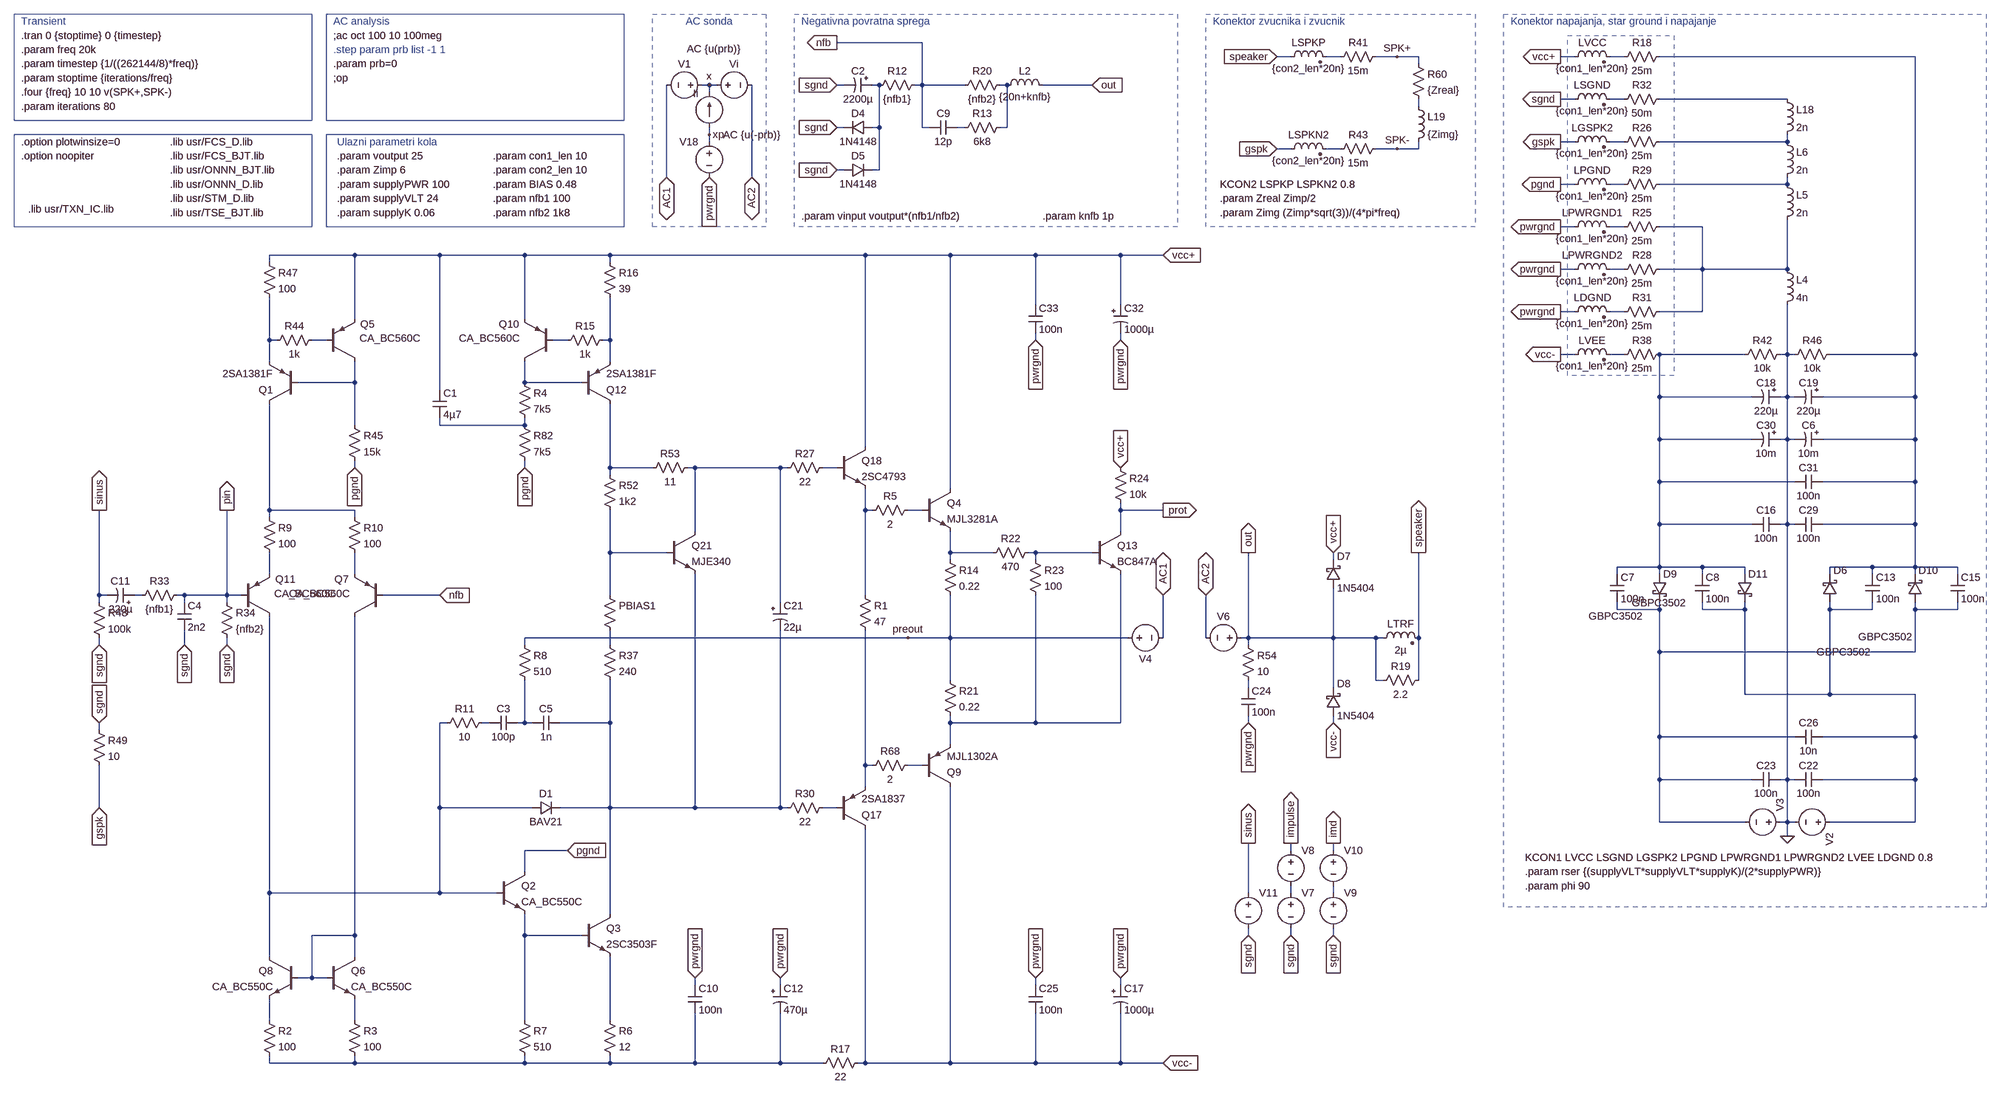
[diagram p0: schematic nano.asc]
nano.asc, the LTspice schematic file:
Version 4
SHEET 1 6124 2336
WIRE 1472 -1568 1280 -1568
WIRE 2304 -1536 2272 -1536
WIRE 2416 -1536 2384 -1536
WIRE 2544 -1536 2496 -1536
WIRE 2592 -1536 2544 -1536
WIRE 2944 -1536 2912 -1536
WIRE 3056 -1536 3024 -1536
WIRE 3712 -1536 3136 -1536
WIRE 2592 -1520 2592 -1536
WIRE 992 -1472 976 -1472
WIRE 1008 -1472 992 -1472
WIRE 1296 -1472 1280 -1472
WIRE 1376 -1472 1360 -1472
WIRE 1472 -1472 1472 -1568
WIRE 1472 -1472 1456 -1472
WIRE 1568 -1472 1472 -1472
WIRE 1664 -1472 1648 -1472
WIRE 1856 -1472 1744 -1472
WIRE 992 -1456 992 -1472
WIRE 2944 -1440 2912 -1440
WIRE 3056 -1440 3024 -1440
WIRE 3424 -1440 3136 -1440
WIRE 2592 -1424 2592 -1440
WIRE 1296 -1376 1280 -1376
WIRE 1376 -1376 1376 -1472
WIRE 1376 -1376 1360 -1376
WIRE 1472 -1376 1472 -1472
WIRE 1488 -1376 1472 -1376
WIRE 1568 -1376 1552 -1376
WIRE 1664 -1376 1664 -1472
WIRE 1664 -1376 1648 -1376
WIRE 992 -1360 992 -1376
WIRE 992 -1344 992 -1360
WIRE 2944 -1344 2912 -1344
WIRE 3056 -1344 3024 -1344
WIRE 3424 -1344 3424 -1360
WIRE 3424 -1344 3136 -1344
WIRE 2304 -1328 2272 -1328
WIRE 2416 -1328 2384 -1328
WIRE 2544 -1328 2496 -1328
WIRE 2592 -1328 2592 -1344
WIRE 2592 -1328 2544 -1328
WIRE 1296 -1280 1280 -1280
WIRE 1376 -1280 1376 -1376
WIRE 1376 -1280 1360 -1280
WIRE 896 -1264 896 -1472
WIRE 1088 -1264 1088 -1472
WIRE 2944 -1248 2912 -1248
WIRE 3056 -1248 3024 -1248
WIRE 3424 -1248 3424 -1264
WIRE 3424 -1248 3136 -1248
WIRE 2944 -1152 2912 -1152
WIRE 3056 -1152 3024 -1152
WIRE 3232 -1152 3136 -1152
WIRE 192 -1088 0 -1088
WIRE 384 -1088 192 -1088
WIRE 576 -1088 384 -1088
WIRE 768 -1088 576 -1088
WIRE 1344 -1088 768 -1088
WIRE 1440 -1088 1344 -1088
WIRE 1536 -1088 1440 -1088
WIRE 1728 -1088 1536 -1088
WIRE 1920 -1088 1728 -1088
WIRE 2016 -1088 1920 -1088
WIRE 0 -1072 0 -1088
WIRE 768 -1072 768 -1088
WIRE 2944 -1056 2912 -1056
WIRE 3056 -1056 3024 -1056
WIRE 3232 -1056 3232 -1152
WIRE 3232 -1056 3136 -1056
WIRE 3424 -1056 3424 -1168
WIRE 3424 -1056 3232 -1056
WIRE 1728 -976 1728 -1088
WIRE 1920 -976 1920 -1088
WIRE 2944 -960 2912 -960
WIRE 3056 -960 3024 -960
WIRE 3232 -960 3232 -1056
WIRE 3232 -960 3136 -960
WIRE 192 -944 192 -1088
WIRE 576 -944 576 -1088
WIRE 0 -896 0 -992
WIRE 16 -896 0 -896
WIRE 128 -896 96 -896
WIRE 672 -896 640 -896
WIRE 768 -896 768 -992
WIRE 768 -896 752 -896
WIRE 1344 -896 1344 -1088
WIRE 1536 -896 1536 -1088
WIRE 1728 -896 1728 -912
WIRE 1920 -896 1920 -912
WIRE 2944 -864 2912 -864
WIRE 3056 -864 3024 -864
WIRE 3328 -864 3136 -864
WIRE 3424 -864 3424 -976
WIRE 3424 -864 3408 -864
WIRE 3440 -864 3424 -864
WIRE 3712 -864 3712 -1536
WIRE 3712 -864 3520 -864
WIRE 0 -848 0 -896
WIRE 768 -848 768 -896
WIRE 192 -800 192 -848
WIRE 192 -800 64 -800
WIRE 576 -800 576 -848
WIRE 704 -800 576 -800
WIRE 384 -784 384 -1088
WIRE 3136 -768 3136 -864
WIRE 3344 -768 3136 -768
WIRE 3424 -768 3424 -864
WIRE 3424 -768 3408 -768
WIRE 3440 -768 3424 -768
WIRE 3712 -768 3712 -864
WIRE 3712 -768 3504 -768
WIRE 192 -704 192 -800
WIRE 384 -704 384 -720
WIRE 576 -704 576 -720
WIRE 576 -704 384 -704
WIRE 0 -672 0 -752
WIRE 768 -672 768 -752
WIRE 3136 -672 3136 -768
WIRE 3344 -672 3136 -672
WIRE 3424 -672 3424 -768
WIRE 3424 -672 3408 -672
WIRE 3440 -672 3424 -672
WIRE 3712 -672 3712 -768
WIRE 3712 -672 3504 -672
WIRE 1344 -656 1344 -896
WIRE 192 -608 192 -624
WIRE 576 -608 576 -624
WIRE 768 -608 768 -672
WIRE 864 -608 768 -608
WIRE 960 -608 944 -608
WIRE 1152 -608 960 -608
WIRE 1168 -608 1152 -608
WIRE 1280 -608 1248 -608
WIRE 768 -592 768 -608
WIRE 3136 -576 3136 -672
WIRE 3440 -576 3136 -576
WIRE 3712 -576 3712 -672
WIRE 3712 -576 3504 -576
WIRE 1536 -560 1536 -896
WIRE 0 -512 0 -672
WIRE 192 -512 0 -512
WIRE 1344 -512 1344 -560
WIRE 1360 -512 1344 -512
WIRE 1472 -512 1440 -512
WIRE 1920 -512 1920 -528
WIRE 2016 -512 1920 -512
WIRE 0 -496 0 -512
WIRE 192 -496 192 -512
WIRE 3136 -480 3136 -576
WIRE 3344 -480 3136 -480
WIRE 3424 -480 3424 -672
WIRE 3424 -480 3408 -480
WIRE 3440 -480 3424 -480
WIRE 3712 -480 3712 -576
WIRE 3712 -480 3504 -480
WIRE 960 -464 960 -608
WIRE 1920 -464 1920 -512
WIRE 768 -416 768 -512
WIRE 896 -416 768 -416
WIRE 1536 -416 1536 -464
WIRE 1632 -416 1536 -416
WIRE 1728 -416 1712 -416
WIRE 1856 -416 1728 -416
WIRE 1536 -400 1536 -416
WIRE 1728 -400 1728 -416
WIRE 2400 -400 2400 -416
WIRE 3136 -384 3136 -480
WIRE 3136 -384 3040 -384
WIRE 3232 -384 3136 -384
WIRE 3328 -384 3232 -384
WIRE 3616 -384 3520 -384
WIRE 3712 -384 3712 -480
WIRE 3712 -384 3616 -384
WIRE 3808 -384 3712 -384
WIRE 0 -368 0 -416
WIRE 192 -368 192 -416
WIRE 3040 -368 3040 -384
WIRE 3136 -368 3136 -384
WIRE 3232 -368 3232 -384
WIRE 3328 -368 3328 -384
WIRE 3520 -368 3520 -384
WIRE 3616 -368 3616 -384
WIRE 3712 -368 3712 -384
WIRE 3808 -368 3808 -384
WIRE -384 -320 -384 -512
WIRE -368 -320 -384 -320
WIRE -288 -320 -304 -320
WIRE -192 -320 -208 -320
WIRE -96 -320 -96 -512
WIRE -96 -320 -192 -320
WIRE -64 -320 -96 -320
WIRE 384 -320 256 -320
WIRE 768 -320 768 -416
WIRE 1344 -320 1344 -512
WIRE -384 -304 -384 -320
WIRE -192 -304 -192 -320
WIRE -96 -304 -96 -320
WIRE 1152 -304 1152 -608
WIRE 3040 -288 3040 -304
WIRE 3136 -288 3136 -304
WIRE 3136 -288 3040 -288
WIRE 3232 -288 3232 -304
WIRE 3328 -288 3328 -304
WIRE 3328 -288 3232 -288
WIRE 3520 -288 3520 -304
WIRE 3616 -288 3616 -304
WIRE 3616 -288 3520 -288
WIRE 3712 -288 3712 -304
WIRE 3808 -288 3808 -304
WIRE 3808 -288 3712 -288
WIRE 1440 -224 576 -224
WIRE 1536 -224 1536 -320
WIRE 1536 -224 1440 -224
WIRE 1632 -224 1536 -224
WIRE 1936 -224 1632 -224
WIRE 2016 -224 2016 -320
WIRE 2112 -224 2112 -320
WIRE 2208 -224 2208 -416
WIRE 2208 -224 2192 -224
WIRE 2400 -224 2400 -336
WIRE 2400 -224 2208 -224
WIRE 2496 -224 2400 -224
WIRE 2512 -224 2496 -224
WIRE 2592 -224 2592 -416
WIRE -384 -208 -384 -224
WIRE -192 -208 -192 -240
WIRE -96 -208 -96 -224
WIRE 576 -208 576 -224
WIRE 768 -208 768 -240
WIRE 2208 -208 2208 -224
WIRE 3136 -192 3136 -288
WIRE 3712 -192 3712 -288
WIRE 3712 -192 3136 -192
WIRE 1536 -128 1536 -224
WIRE 2496 -128 2496 -224
WIRE 2512 -128 2496 -128
WIRE 2592 -128 2592 -224
WIRE 2208 -112 2208 -128
WIRE 2400 -112 2400 -224
WIRE 3328 -96 3328 -288
WIRE 3520 -96 3520 -288
WIRE 3520 -96 3328 -96
WIRE 3712 -96 3520 -96
WIRE 400 -32 384 -32
WIRE 496 -32 480 -32
WIRE 576 -32 576 -128
WIRE 576 -32 560 -32
WIRE 592 -32 576 -32
WIRE 768 -32 768 -128
WIRE 768 -32 656 -32
WIRE 1536 -32 1536 -48
WIRE 1728 -32 1728 -320
WIRE 1728 -32 1536 -32
WIRE 1920 -32 1920 -368
WIRE 1920 -32 1728 -32
WIRE 2208 -32 2208 -48
WIRE 2400 -32 2400 -48
WIRE -384 -16 -384 -32
WIRE 3136 0 3136 -192
WIRE 3440 0 3136 0
WIRE 3712 0 3712 -96
WIRE 3712 0 3504 0
WIRE 1536 16 1536 -32
WIRE 1344 64 1344 -240
WIRE 1360 64 1344 64
WIRE 1472 64 1440 64
WIRE 3136 96 3136 0
WIRE 3344 96 3136 96
WIRE 3424 96 3424 -480
WIRE 3424 96 3408 96
WIRE 3440 96 3424 96
WIRE 3712 96 3712 0
WIRE 3712 96 3504 96
WIRE 1344 112 1344 64
WIRE -384 160 -384 64
WIRE 384 160 384 -32
WIRE 592 160 384 160
WIRE 768 160 768 -32
WIRE 768 160 656 160
WIRE 960 160 960 -368
WIRE 960 160 768 160
WIRE 1152 160 1152 -240
WIRE 1152 160 960 160
WIRE 1168 160 1152 160
WIRE 1280 160 1248 160
WIRE 3136 192 3136 96
WIRE 3328 192 3136 192
WIRE 3424 192 3424 96
WIRE 3424 192 3408 192
WIRE 3440 192 3424 192
WIRE 3712 192 3712 96
WIRE 3712 192 3520 192
WIRE 3424 224 3424 192
WIRE 672 256 576 256
WIRE 2304 256 2304 240
WIRE 2400 256 2400 240
WIRE 576 304 576 256
WIRE 0 352 0 -272
WIRE 384 352 384 160
WIRE 384 352 0 352
WIRE 512 352 384 352
WIRE 2208 352 2208 240
WIRE 2304 352 2304 336
WIRE 2400 352 2400 336
WIRE 768 400 768 160
WIRE 192 448 192 -272
WIRE 192 448 96 448
WIRE 576 448 576 400
WIRE 704 448 576 448
WIRE 2208 448 2208 432
WIRE 2304 448 2304 432
WIRE 2400 448 2400 432
WIRE 0 496 0 352
WIRE 192 496 192 448
WIRE 96 544 96 448
WIRE 96 544 64 544
WIRE 128 544 96 544
WIRE 960 560 960 544
WIRE 1152 560 1152 544
WIRE 1728 560 1728 544
WIRE 1920 560 1920 544
WIRE 0 640 0 592
WIRE 192 640 192 592
WIRE 576 640 576 448
WIRE 768 640 768 496
WIRE 0 736 0 720
WIRE 192 736 192 720
WIRE 192 736 0 736
WIRE 576 736 576 720
WIRE 576 736 192 736
WIRE 768 736 768 720
WIRE 768 736 576 736
WIRE 960 736 960 624
WIRE 960 736 768 736
WIRE 1152 736 1152 624
WIRE 1152 736 960 736
WIRE 1248 736 1152 736
WIRE 1344 736 1344 208
WIRE 1344 736 1328 736
WIRE 1440 736 1344 736
WIRE 1536 736 1536 112
WIRE 1536 736 1440 736
WIRE 1728 736 1728 624
WIRE 1728 736 1536 736
WIRE 1920 736 1920 624
WIRE 1920 736 1728 736
WIRE 2016 736 1920 736
FLAG 2016 -1088 vcc+
IOPIN 2016 -1088 In
FLAG 992 -1472 x
FLAG 2016 736 vcc-
IOPIN 2016 736 In
FLAG 2208 -416 out
IOPIN 2208 -416 Out
FLAG 1280 -1568 nfb
IOPIN 1280 -1568 Out
FLAG 384 -320 nfb
IOPIN 384 -320 In
FLAG 992 -1360 xp
FLAG 2208 -32 pwrgnd
IOPIN 2208 -32 In
FLAG -192 -208 sgnd
IOPIN -192 -208 In
FLAG -96 -208 sgnd
IOPIN -96 -208 In
FLAG 1280 -1472 sgnd
IOPIN 1280 -1472 In
FLAG 2208 448 sgnd
IOPIN 2208 448 In
FLAG 2208 240 sinus
IOPIN 2208 240 Out
FLAG 1152 544 pwrgnd
IOPIN 1152 544 In
FLAG 192 -608 pgnd
IOPIN 192 -608 In
FLAG 576 -608 pgnd
IOPIN 576 -608 In
FLAG 2912 -1536 vcc+
IOPIN 2912 -1536 Out
FLAG 2912 -864 vcc-
IOPIN 2912 -864 Out
FLAG 2912 -1344 gspk
IOPIN 2912 -1344 Out
FLAG 2912 -1056 pwrgnd
IOPIN 2912 -1056 Out
FLAG 2912 -1248 pgnd
IOPIN 2912 -1248 Out
FLAG 2912 -1440 sgnd
IOPIN 2912 -1440 Out
FLAG 1856 -1472 out
IOPIN 1856 -1472 In
FLAG 2592 -416 speaker
IOPIN 2592 -416 Out
FLAG 2272 -1328 gspk
IOPIN 2272 -1328 In
FLAG 2272 -1536 speaker
IOPIN 2272 -1536 In
FLAG 2912 -1152 pwrgnd
IOPIN 2912 -1152 Out
FLAG 960 544 pwrgnd
IOPIN 960 544 In
FLAG 2304 240 impulse
IOPIN 2304 240 Out
FLAG 2912 -960 pwrgnd
IOPIN 2912 -960 Out
FLAG 3424 224 0
FLAG 896 -1264 AC1
IOPIN 896 -1264 BiDir
FLAG 1088 -1264 AC2
IOPIN 1088 -1264 BiDir
FLAG 2016 -320 AC1
IOPIN 2016 -320 BiDir
FLAG 2112 -320 AC2
IOPIN 2112 -320 BiDir
FLAG 992 -1264 pwrgnd
IOPIN 992 -1264 In
FLAG 2544 -1536 SPK+
FLAG 2544 -1328 SPK-
FLAG 2400 240 imd
IOPIN 2400 240 Out
FLAG 672 256 pgnd
IOPIN 672 256 In
FLAG 2400 -416 vcc+
IOPIN 2400 -416 In
FLAG 2400 -32 vcc-
IOPIN 2400 -32 In
FLAG 2304 448 sgnd
IOPIN 2304 448 In
FLAG 2400 448 sgnd
IOPIN 2400 448 In
FLAG 1728 544 pwrgnd
IOPIN 1728 544 In
FLAG 1920 544 pwrgnd
IOPIN 1920 544 In
FLAG 1920 -896 pwrgnd
IOPIN 1920 -896 In
FLAG 1728 -896 pwrgnd
IOPIN 1728 -896 In
FLAG -384 -208 sgnd
IOPIN -384 -208 In
FLAG -384 -32 sgnd
IOPIN -384 -32 In
FLAG -384 160 gspk
IOPIN -384 160 In
FLAG 1440 -224 preout
FLAG -96 -512 pin
IOPIN -96 -512 Out
FLAG 1280 -1376 sgnd
IOPIN 1280 -1376 In
FLAG 1280 -1280 sgnd
IOPIN 1280 -1280 In
FLAG 2016 -512 prot
IOPIN 2016 -512 Out
FLAG 1920 -608 vcc+
IOPIN 1920 -608 In
FLAG -384 -512 sinus
IOPIN -384 -512 Out
DATAFLAG 768 -672 "-Ic(Q12)"
DATAFLAG 1440 -1088 ""
DATAFLAG 1440 736 ""
DATAFLAG 1344 -896 "Ic(Q18)"
DATAFLAG 0 -672 "-Ic(Q1)"
DATAFLAG 1632 -224 ""
DATAFLAG 1536 -896 "Ic(Q4)"
SYMBOL res 1472 -1488 R90
WINDOW 0 0 56 VBottom 2
WINDOW 3 32 56 VTop 2
SYMATTR InstName R12
SYMATTR Value {nfb1}
SYMBOL voltage 3536 192 R90
WINDOW 123 0 0 Left 2
WINDOW 3 -94 177 Invisible 2
SYMATTR Value SINE(0 {supplyVLT*sqrt(2)} 50 1m 0 {phi})
SYMATTR SpiceLine Rser={rser}
SYMATTR InstName V2
SYMBOL current 992 -1376 R180
WINDOW 0 24 77 Left 2
WINDOW 3 24 0 Invisible 2
WINDOW 123 -71 178 Left 2
WINDOW 39 0 0 Left 2
SYMATTR InstName Ii
SYMATTR Value 0
SYMATTR Value2 AC {u(prb)}
SYMBOL voltage 992 -1472 R270
WINDOW 0 32 56 VTop 2
WINDOW 3 -32 56 Invisible 2
WINDOW 123 -97 96 VBottom 2
WINDOW 39 -32 56 VBottom 2
SYMATTR InstName Vi
SYMATTR Value 0
SYMATTR Value2 AC {u(-prb)}
SYMBOL pnp -64 -272 M180
WINDOW 0 77 84 Left 2
WINDOW 3 75 52 Left 2
SYMATTR InstName Q11
SYMATTR Value CA_BC560C
SYMBOL res -304 -304 R270
WINDOW 0 32 56 VTop 2
WINDOW 3 0 56 VBottom 2
SYMATTR InstName R33
SYMATTR Value {nfb1}
SYMBOL res -112 -320 R0
SYMATTR InstName R34
SYMATTR Value {nfb2}
SYMBOL res -16 624 R0
SYMATTR InstName R2
SYMATTR Value 100
SYMBOL res 176 624 R0
SYMATTR InstName R3
SYMATTR Value 100
SYMBOL res -16 -512 R0
SYMATTR InstName R9
SYMATTR Value 100
SYMBOL res 176 -512 R0
SYMATTR InstName R10
SYMATTR Value 100
SYMBOL res 752 -1088 R0
SYMATTR InstName R16
SYMATTR Value 39
SYMBOL pnp 704 -752 M180
SYMATTR InstName Q12
SYMATTR Value 2SA1381F
SYMBOL schottky 2384 -336 M180
WINDOW 0 24 72 Left 2
WINDOW 3 24 0 Left 2
SYMATTR InstName D7
SYMATTR Value 1N5404
SYMATTR Description Diode
SYMATTR Type diode
SYMBOL schottky 2384 -48 M180
WINDOW 0 24 72 Left 2
WINDOW 3 24 0 Left 2
SYMATTR InstName D8
SYMATTR Value 1N5404
SYMATTR Description Diode
SYMATTR Type diode
SYMBOL ind2 2496 -208 R270
WINDOW 0 32 56 VTop 2
WINDOW 3 4 56 VBottom 2
SYMATTR InstName LTRF
SYMATTR Value 2µ
SYMATTR SpiceLine Rser=10m Rpar=3meg Cpar=1p
SYMATTR Type ind
SYMBOL res 2496 -112 R270
WINDOW 0 32 56 VTop 2
WINDOW 3 0 56 VBottom 2
SYMATTR InstName R19
SYMATTR Value 2.2
SYMBOL res 1664 -1488 R90
WINDOW 0 0 56 VBottom 2
WINDOW 3 32 56 VTop 2
SYMATTR InstName R20
SYMATTR Value {nfb2}
SYMBOL voltage 992 -1472 R90
WINDOW 0 -32 56 VBottom 2
WINDOW 3 32 56 Invisible 2
WINDOW 123 0 0 Left 2
WINDOW 39 0 0 Left 2
SYMATTR InstName V1
SYMATTR Value 0
SYMBOL schottky 3504 -304 M180
WINDOW 0 24 72 Left 2
WINDOW 3 -14 -112 Left 2
SYMATTR InstName D6
SYMATTR Value GBPC3502
SYMATTR Description Diode
SYMATTR Type diode
SYMBOL schottky 3120 -368 R0
WINDOW 3 -144 95 Left 2
SYMATTR Value GBPC3502
SYMATTR InstName D9
SYMATTR Description Diode
SYMATTR Type diode
SYMBOL voltage 3424 192 M270
WINDOW 123 0 0 Left 2
WINDOW 3 -96 -62 Invisible 2
SYMATTR Value SINE(0 {supplyVLT*sqrt(2)} 50 1m 0 {phi})
SYMATTR SpiceLine Rser={rser}
SYMATTR InstName V3
SYMBOL res 2192 -224 R0
SYMATTR InstName R54
SYMATTR Value 10
SYMBOL res 2576 -1536 R0
SYMATTR InstName R60
SYMATTR Value {Zreal}
SYMBOL ind 2576 -1440 R0
SYMATTR InstName L19
SYMATTR Value {Zimg}
SYMATTR SpiceLine Cpar=10p
SYMBOL voltage 992 -1360 M0
WINDOW 123 0 0 Left 2
WINDOW 39 0 0 Left 2
WINDOW 3 24 96 Invisible 2
SYMATTR Value 0
SYMATTR InstName V18
SYMBOL pnp 1280 208 M180
SYMATTR InstName Q17
SYMATTR Value 2SA1837
SYMBOL npn 1280 -656 R0
SYMATTR InstName Q18
SYMATTR Value 2SC4793
SYMBOL res 1264 -624 R90
WINDOW 0 0 56 VBottom 2
WINDOW 3 32 56 VTop 2
SYMATTR InstName R27
SYMATTR Value 22
SYMBOL res 1264 144 R90
WINDOW 0 0 56 VBottom 2
WINDOW 3 32 56 VTop 2
SYMATTR InstName R30
SYMATTR Value 22
SYMBOL cap 2192 -112 R0
SYMATTR InstName C24
SYMATTR Value 100n
SYMATTR SpiceLine Rser=700m Lser=7n Rpar=4.4meg Cpar=1p
SYMBOL cap 1712 624 M180
WINDOW 0 24 56 Left 2
WINDOW 3 24 8 Left 2
SYMATTR InstName C25
SYMATTR Value 100n
SYMATTR SpiceLine Rser=700m Lser=7n Rpar=4.4meg Cpar=1p
SYMBOL polcap 1360 -1488 R90
WINDOW 0 0 32 VBottom 2
WINDOW 3 32 32 VTop 2
SYMATTR InstName C2
SYMATTR Value 2200µ
SYMATTR SpiceLine V=6.3 Irms=1.44 Rser=0.09 Lser=5.5n Rpar=1110k Cpar=3p mfg="Nichicon" pn="UPW0J222MPD6TD" type="Al electrolytic"
SYMATTR Description Capacitor
SYMATTR Type cap
SYMBOL res -16 -1088 R0
SYMATTR InstName R47
SYMATTR Value 100
SYMBOL res 752 -336 R0
WINDOW 3 36 76 Invisible 2
SYMATTR Value {1+(500*BIAS)}
SYMATTR InstName PBIAS1
SYMBOL res 752 -608 R0
SYMATTR InstName R52
SYMATTR Value 1k2
SYMBOL res 960 -624 R90
WINDOW 0 0 56 VBottom 2
WINDOW 3 32 56 VTop 2
SYMATTR InstName R53
SYMATTR Value 11
SYMBOL schottky 3696 -304 M180
WINDOW 0 24 72 Left 2
WINDOW 3 -112 -78 Left 2
SYMATTR InstName D10
SYMATTR Value GBPC3502
SYMATTR Description Diode
SYMATTR Type diode
SYMBOL schottky 3312 -368 R0
WINDOW 3 -239 65 Left 2
SYMATTR Value GBPC3502
SYMATTR InstName D11
SYMATTR Description Diode
SYMATTR Type diode
SYMBOL ind2 2928 -1520 R270
WINDOW 0 32 56 VTop 2
WINDOW 3 5 56 VBottom 2
SYMATTR InstName LVCC
SYMATTR Value {con1_len*20n}
SYMATTR SpiceLine Rser={con1_len*.5m}
SYMATTR Type ind
SYMBOL ind2 2928 -848 R270
WINDOW 0 32 56 VTop 2
WINDOW 3 5 56 VBottom 2
SYMATTR InstName LVEE
SYMATTR Value {con1_len*20n}
SYMATTR SpiceLine Rser={con1_len*.5m}
SYMATTR Type ind
SYMBOL npn 704 400 R0
SYMATTR InstName Q3
SYMATTR Value 2SC3503F
SYMBOL res 752 624 R0
SYMATTR InstName R6
SYMATTR Value 12
SYMBOL voltage 2208 336 R0
WINDOW 123 24 44 Left 2
WINDOW 39 0 0 Left 2
WINDOW 3 24 96 Invisible 2
SYMATTR Value SINE(0 {vinput} {freq})
SYMATTR InstName V11
SYMBOL res 560 -816 R0
SYMATTR InstName R4
SYMATTR Value 7k5
SYMBOL res 1328 -336 R0
SYMATTR InstName R1
SYMATTR Value 47
SYMBOL pnp 64 -752 R180
SYMATTR InstName Q1
SYMATTR Value 2SA1381F
SYMBOL pnp 256 -272 R180
WINDOW 0 77 84 Left 2
WINDOW 3 75 52 Left 2
SYMATTR InstName Q7
SYMATTR Value CA_BC560C
SYMBOL npn 896 -464 R0
SYMATTR InstName Q21
SYMATTR Value MJE340
SYMBOL res 1344 720 R90
WINDOW 0 0 56 VBottom 2
WINDOW 3 32 56 VTop 2
SYMATTR InstName R17
SYMATTR Value 22
SYMBOL ind2 2928 -1328 R270
WINDOW 0 32 56 VTop 2
WINDOW 3 5 56 VBottom 2
SYMATTR InstName LGSPK2
SYMATTR Value {con1_len*20n}
SYMATTR SpiceLine Rser={con1_len*.5m}
SYMATTR Type ind
SYMBOL ind2 2928 -1040 R270
WINDOW 0 32 56 VTop 2
WINDOW 3 5 56 VBottom 2
SYMATTR InstName LPWRGND2
SYMATTR Value {con1_len*20n}
SYMATTR SpiceLine Rser={con1_len*.5m}
SYMATTR Type ind
SYMBOL ind2 2928 -1232 R270
WINDOW 0 32 56 VTop 2
WINDOW 3 5 56 VBottom 2
SYMATTR InstName LPGND
SYMATTR Value {con1_len*20n}
SYMATTR SpiceLine Rser={con1_len*.5m}
SYMATTR Type ind
SYMBOL ind2 2928 -1424 R270
WINDOW 0 32 56 VTop 2
WINDOW 3 5 56 VBottom 2
SYMATTR InstName LSGND
SYMATTR Value {con1_len*20n}
SYMATTR SpiceLine Rser={con1_len*.5m}
SYMATTR Type ind
SYMBOL res 3152 -1552 R90
WINDOW 0 0 56 VBottom 2
WINDOW 3 32 56 VTop 2
SYMATTR InstName R18
SYMATTR Value 25m
SYMBOL res 3152 -1360 R90
WINDOW 0 0 56 VBottom 2
WINDOW 3 32 56 VTop 2
SYMATTR InstName R26
SYMATTR Value 25m
SYMBOL res 3152 -1072 R90
WINDOW 0 0 56 VBottom 2
WINDOW 3 32 56 VTop 2
SYMATTR InstName R28
SYMATTR Value 25m
SYMBOL res 3152 -1264 R90
WINDOW 0 0 56 VBottom 2
WINDOW 3 32 56 VTop 2
SYMATTR InstName R29
SYMATTR Value 25m
SYMBOL res 3152 -1456 R90
WINDOW 0 0 56 VBottom 2
WINDOW 3 32 56 VTop 2
SYMATTR InstName R32
SYMATTR Value 50m
SYMBOL res 3152 -880 R90
WINDOW 0 0 56 VBottom 2
WINDOW 3 32 56 VTop 2
SYMATTR InstName R38
SYMATTR Value 25m
SYMBOL ind 3408 -1072 R0
SYMATTR InstName L4
SYMATTR Value 4n
SYMATTR SpiceLine Rser=1m
SYMBOL ind 3408 -1264 R0
SYMATTR InstName L5
SYMATTR Value 2n
SYMATTR SpiceLine Rser=1m
SYMBOL ind 3408 -1360 R0
SYMATTR InstName L6
SYMATTR Value 2n
SYMATTR SpiceLine Rser=1m
SYMBOL ind 3408 -1456 R0
SYMATTR InstName L18
SYMATTR Value 2n
SYMATTR SpiceLine Rser=1m
SYMBOL ind2 2288 -1520 R270
WINDOW 0 32 56 VTop 2
WINDOW 3 5 56 VBottom 2
SYMATTR InstName LSPKP
SYMATTR Value {con2_len*20n}
SYMATTR SpiceLine Rser={con2_len*.5m}
SYMATTR Type ind
SYMBOL ind2 2288 -1312 R270
WINDOW 0 32 56 VTop 2
WINDOW 3 5 56 VBottom 2
SYMATTR InstName LSPKN2
SYMATTR Value {con2_len*20n}
SYMATTR SpiceLine Rser={con2_len*.5m}
SYMATTR Type ind
SYMBOL res 2512 -1552 R90
WINDOW 0 0 56 VBottom 2
WINDOW 3 32 56 VTop 2
SYMATTR InstName R41
SYMATTR Value 15m
SYMBOL res 2512 -1344 R90
WINDOW 0 0 56 VBottom 2
WINDOW 3 32 56 VTop 2
SYMATTR InstName R43
SYMATTR Value 15m
SYMBOL ind2 2928 -944 R270
WINDOW 0 32 56 VTop 2
WINDOW 3 5 56 VBottom 2
SYMATTR InstName LDGND
SYMATTR Value {con1_len*20n}
SYMATTR SpiceLine Rser={con1_len*.5m}
SYMATTR Type ind
SYMBOL res 3152 -976 R90
WINDOW 0 0 56 VBottom 2
WINDOW 3 32 56 VTop 2
SYMATTR InstName R31
SYMATTR Value 25m
SYMBOL ind2 2928 -1136 R270
WINDOW 0 32 56 VTop 2
WINDOW 3 5 56 VBottom 2
SYMATTR InstName LPWRGND1
SYMATTR Value {con1_len*20n}
SYMATTR SpiceLine Rser={con1_len*.5m}
SYMATTR Type ind
SYMBOL res 3152 -1168 R90
WINDOW 0 0 56 VBottom 2
WINDOW 3 32 56 VTop 2
SYMATTR InstName R25
SYMATTR Value 25m
SYMBOL cap 944 560 R0
SYMATTR InstName C10
SYMATTR Value 100n
SYMATTR SpiceLine Rser=700m Lser=7n Rpar=4.4meg Cpar=1p
SYMBOL voltage 2304 336 R0
WINDOW 3 24 96 Invisible 2
WINDOW 123 0 0 Left 2
WINDOW 39 0 0 Left 2
SYMATTR Value PULSE(0 {vinput/2} 1u 1n 1n {1/(freq*2)} {1/freq})
SYMATTR InstName V7
SYMBOL voltage 2304 240 R0
WINDOW 3 24 96 Invisible 2
WINDOW 123 0 0 Left 2
WINDOW 39 0 0 Left 2
SYMATTR Value PULSE(0 {-vinput/2} {1u+(1/(freq*2))} 1n 1n {1/(freq*2)} {1/freq})
SYMATTR InstName V8
SYMBOL polcap -304 -304 M270
WINDOW 3 0 32 VBottom 2
WINDOW 0 32 32 VTop 2
SYMATTR Value 220µ
SYMATTR InstName C11
SYMATTR SpiceLine V=6.3 Irms=290m Rser=0.5 Lser=3n Rpar=1100k Cpar=3p mfg="Nichicon" pn="UPW0J221MED1TD" type="Al electrolytic"
SYMATTR Description Capacitor
SYMATTR Type cap
SYMBOL polcap 1136 560 R0
SYMATTR Value 470µ
SYMATTR InstName C12
SYMATTR SpiceLine V=6.3 Irms=290m Rser=0.5 Lser=3n Rpar=1100k Cpar=3p
SYMATTR Description Capacitor
SYMATTR Type cap
SYMBOL polcap 1904 560 R0
SYMATTR InstName C17
SYMATTR Value 1000µ
SYMATTR SpiceLine V=63 Irms=2.77 Rser=0.036 Lser=5n Rpar=900k Cpar=3p mfg="Nichicon" pn="UPW1J102MHD6" type="Al electrolytic"
SYMATTR Description Capacitor
SYMATTR Type cap
SYMBOL polcap 1136 -304 R0
SYMATTR InstName C21
SYMATTR Value 22µ
SYMATTR SpiceLine V=100 Irms=250m Rser=0.71 Lser=2n Rpar=2meg Cpar=2p mfg="Nichicon" pn="UPW1J220MED" type="Al electrolytic"
SYMATTR Description Capacitor
SYMATTR Type cap
SYMBOL res 752 -224 R0
SYMATTR InstName R37
SYMATTR Value 240
SYMBOL voltage 1920 -224 R270
WINDOW 0 -32 56 VBottom 2
WINDOW 3 32 56 Invisible 2
WINDOW 123 0 0 Left 2
WINDOW 39 0 0 Left 2
SYMATTR InstName V4
SYMATTR Value 0
SYMBOL voltage 2208 -224 R90
WINDOW 0 -32 56 VBottom 2
WINDOW 3 32 56 Invisible 2
WINDOW 123 0 0 Left 2
WINDOW 39 0 0 Left 2
SYMATTR InstName V6
SYMATTR Value 0
SYMBOL voltage 2400 336 R0
WINDOW 3 24 96 Invisible 2
WINDOW 123 0 0 Left 2
WINDOW 39 0 0 Left 2
SYMATTR Value SINE(0 {vinput/2} 19k)
SYMATTR InstName V9
SYMBOL voltage 2400 240 R0
WINDOW 3 24 96 Invisible 2
WINDOW 123 0 0 Left 2
WINDOW 39 0 0 Left 2
SYMATTR Value SINE(0 {vinput/2} 20k 0 0)
SYMATTR InstName V10
SYMBOL ind 1648 -1456 R270
WINDOW 0 32 56 VTop 2
WINDOW 3 5 56 VBottom 2
SYMATTR InstName L2
SYMATTR Value {20n+knfb}
SYMBOL res 560 -720 R0
SYMATTR InstName R82
SYMATTR Value 7k5
SYMBOL npn 1472 -560 R0
SYMATTR InstName Q4
SYMATTR Value MJL3281A
SYMBOL pnp 1472 112 M180
SYMATTR InstName Q9
SYMATTR Value MJL1302A
SYMBOL res 1456 -528 R90
WINDOW 0 0 56 VBottom 2
WINDOW 3 32 56 VTop 2
SYMATTR InstName R5
SYMATTR Value 2
SYMBOL res 1456 48 R90
WINDOW 0 0 56 VBottom 2
WINDOW 3 32 56 VTop 2
SYMATTR InstName R68
SYMATTR Value 2
SYMBOL cap 560 -48 R90
WINDOW 0 0 32 VBottom 2
WINDOW 3 32 32 VTop 2
SYMATTR InstName C3
SYMATTR Value 100p
SYMATTR SpiceLine Rser=140m Lser=3n Rpar=7.4meg
SYMBOL res 1664 -1392 R90
WINDOW 0 0 56 VBottom 2
WINDOW 3 32 56 VTop 2
SYMATTR InstName R13
SYMATTR Value 6k8
SYMBOL cap 1552 -1392 R90
WINDOW 0 0 32 VBottom 2
WINDOW 3 32 32 VTop 2
SYMATTR InstName C9
SYMATTR Value 12p
SYMATTR SpiceLine Rser=140m Lser=3n Rpar=7.4meg
SYMBOL res 176 -720 R0
SYMATTR InstName R45
SYMATTR Value 15k
SYMBOL npn 128 496 R0
SYMATTR InstName Q6
SYMATTR Value CA_BC550C
SYMBOL npn 64 496 M0
SYMATTR InstName Q8
SYMATTR Value CA_BC550C
SYMBOL res 768 -912 R90
WINDOW 0 0 56 VBottom 2
WINDOW 3 32 56 VTop 2
SYMATTR InstName R15
SYMATTR Value 1k
SYMBOL res 112 -912 R90
WINDOW 0 0 56 VBottom 2
WINDOW 3 32 56 VTop 2
SYMATTR InstName R44
SYMATTR Value 1k
SYMBOL npn 512 304 R0
SYMATTR InstName Q2
SYMATTR Value CA_BC550C
SYMBOL res 560 624 R0
SYMATTR InstName R7
SYMATTR Value 510
SYMBOL cap 656 -48 R90
WINDOW 0 0 32 VBottom 2
WINDOW 3 32 32 VTop 2
SYMATTR InstName C5
SYMATTR Value 1n
SYMATTR SpiceLine Rser=140m Lser=3n Rpar=7.4meg
SYMBOL res 560 -224 R0
SYMATTR InstName R8
SYMATTR Value 510
SYMBOL diode 592 176 R270
WINDOW 0 32 32 VTop 2
WINDOW 3 0 32 VBottom 2
SYMATTR InstName D1
SYMATTR Value BAV21
SYMBOL pnp 128 -848 M180
WINDOW 0 77 84 Left 2
WINDOW 3 75 52 Left 2
SYMATTR InstName Q5
SYMATTR Value CA_BC560C
SYMBOL pnp 640 -848 R180
WINDOW 0 77 84 Left 2
WINDOW 3 75 52 Left 2
SYMATTR InstName Q10
SYMATTR Value CA_BC560C
SYMBOL res 496 -48 R90
WINDOW 0 0 56 VBottom 2
WINDOW 3 32 56 VTop 2
SYMATTR InstName R11
SYMATTR Value 10
SYMBOL cap 368 -784 R0
SYMATTR InstName C1
SYMATTR Value 4µ7
SYMATTR SpiceLine Rser=700m Lser=7n Rpar=4.4meg Cpar=1p
SYMBOL res 1520 -416 R0
SYMATTR InstName R14
SYMATTR Value 0.22
SYMBOL res 1520 -144 R0
SYMATTR InstName R21
SYMATTR Value 0.22
SYMBOL cap 3024 -368 R0
SYMATTR InstName C7
SYMATTR Value 100n
SYMATTR SpiceLine Rser=700m Lser=7n Rpar=4.4meg Cpar=1p
SYMBOL cap 3216 -368 R0
SYMATTR InstName C8
SYMATTR Value 100n
SYMATTR SpiceLine Rser=700m Lser=7n Rpar=4.4meg Cpar=1p
SYMBOL cap 3600 -368 R0
SYMATTR InstName C13
SYMATTR Value 100n
SYMATTR SpiceLine Rser=700m Lser=7n Rpar=4.4meg Cpar=1p
SYMBOL cap 3792 -368 R0
SYMATTR InstName C15
SYMATTR Value 100n
SYMATTR SpiceLine Rser=700m Lser=7n Rpar=4.4meg Cpar=1p
SYMBOL polcap 3408 -784 R90
WINDOW 0 0 32 VBottom 2
WINDOW 3 32 32 VTop 2
SYMATTR InstName C18
SYMATTR Value 220µ
SYMATTR SpiceLine V=50 Irms=1.04 Rser=0.075 Lser=0 Rpar=40k Cpar=3p mfg="Nichicon" pn="UPL1H221MPH" type="Al electrolytic"
SYMATTR Description Capacitor
SYMATTR Type cap
SYMBOL polcap 3504 -784 R90
WINDOW 0 0 32 VBottom 2
WINDOW 3 32 32 VTop 2
SYMATTR InstName C19
SYMATTR Value 220µ
SYMATTR SpiceLine V=50 Irms=1.04 Rser=0.075 Lser=0 Rpar=40k Cpar=3p mfg="Nichicon" pn="UPL1H221MPH" type="Al electrolytic"
SYMATTR Description Capacitor
SYMATTR Type cap
SYMBOL cap 3440 80 M90
WINDOW 0 0 32 VBottom 2
WINDOW 3 32 32 VTop 2
SYMATTR InstName C22
SYMATTR Value 100n
SYMATTR SpiceLine Rser=700m Lser=7n Rpar=4.4meg Cpar=1p
SYMBOL cap 3344 80 M90
WINDOW 0 0 32 VBottom 2
WINDOW 3 32 32 VTop 2
SYMATTR InstName C23
SYMATTR Value 100n
SYMATTR SpiceLine Rser=700m Lser=7n Rpar=4.4meg Cpar=1p
SYMBOL cap 3440 -16 M90
WINDOW 0 0 32 VBottom 2
WINDOW 3 32 32 VTop 2
SYMATTR InstName C26
SYMATTR Value 10n
SYMATTR SpiceLine Rser=700m Lser=7n Rpar=4.4meg Cpar=1p
SYMBOL polcap 3408 -688 R90
WINDOW 0 0 32 VBottom 2
WINDOW 3 32 32 VTop 2
SYMATTR InstName C30
SYMATTR Value 10m
SYMATTR SpiceLine V=50 Irms=2.5 Rser=0.08 Lser=20n Rpar=40k Cpar=3p
SYMATTR Description Capacitor
SYMATTR Type cap
SYMBOL polcap 3504 -688 R90
WINDOW 0 0 32 VBottom 2
WINDOW 3 32 32 VTop 2
SYMATTR InstName C6
SYMATTR Value 10m
SYMATTR SpiceLine V=50 Irms=2.5 Rser=0.08 Lser=20n Rpar=40k Cpar=3p
SYMATTR Description Capacitor
SYMATTR Type cap
SYMBOL res 3424 -880 R90
WINDOW 0 0 56 VBottom 2
WINDOW 3 32 56 VTop 2
SYMATTR InstName R42
SYMATTR Value 10k
SYMBOL res 3536 -880 R90
WINDOW 0 0 56 VBottom 2
WINDOW 3 32 56 VTop 2
SYMATTR InstName R46
SYMATTR Value 10k
SYMBOL cap 3344 -496 M90
WINDOW 0 0 32 VBottom 2
WINDOW 3 32 32 VTop 2
SYMATTR InstName C16
SYMATTR Value 100n
SYMATTR SpiceLine Rser=700m Lser=7n Rpar=4.4meg Cpar=1p
SYMBOL cap 3440 -496 M90
WINDOW 0 0 32 VBottom 2
WINDOW 3 32 32 VTop 2
SYMATTR InstName C29
SYMATTR Value 100n
SYMATTR SpiceLine Rser=700m Lser=7n Rpar=4.4meg Cpar=1p
SYMBOL cap 3440 -592 M90
WINDOW 0 0 32 VBottom 2
WINDOW 3 32 32 VTop 2
SYMATTR InstName C31
SYMATTR Value 100n
SYMATTR SpiceLine Rser=700m Lser=7n Rpar=4.4meg Cpar=1p
SYMBOL polcap 1904 -976 R0
SYMATTR InstName C32
SYMATTR Value 1000µ
SYMATTR SpiceLine V=63 Irms=2.77 Rser=0.036 Lser=5n Rpar=900k Cpar=3p mfg="Nichicon" pn="UPW1J102MHD6" type="Al electrolytic"
SYMATTR Description Capacitor
SYMATTR Type cap
SYMBOL cap 1712 -976 R0
SYMATTR InstName C33
SYMATTR Value 100n
SYMATTR SpiceLine Rser=700m Lser=7n Rpar=4.4meg Cpar=1p
SYMBOL res -400 -320 R0
SYMATTR InstName R48
SYMATTR Value 100k
SYMBOL res -400 -32 R0
SYMATTR InstName R49
SYMATTR Value 10
SYMBOL cap -208 -240 M180
WINDOW 0 24 56 Left 2
WINDOW 3 24 8 Left 2
SYMATTR InstName C4
SYMATTR Value 2n2
SYMATTR SpiceLine Rser=140m Lser=3n Rpar=7.4meg
SYMBOL diode 1360 -1392 R90
WINDOW 0 0 32 VBottom 2
WINDOW 3 32 32 VTop 2
SYMATTR InstName D4
SYMATTR Value 1N4148
SYMBOL diode 1296 -1264 R270
WINDOW 0 32 32 VTop 2
WINDOW 3 0 32 VBottom 2
SYMATTR InstName D5
SYMATTR Value 1N4148
SYMBOL npn 1856 -464 R0
SYMATTR InstName Q13
SYMATTR Value BC847A
SYMBOL res 1728 -432 R90
WINDOW 0 0 56 VBottom 2
WINDOW 3 32 56 VTop 2
SYMATTR InstName R22
SYMATTR Value 470
SYMBOL res 1712 -416 R0
SYMATTR InstName R23
SYMATTR Value 100
SYMBOL res 1904 -624 R0
SYMATTR InstName R24
SYMATTR Value 10k
TEXT 144 -1488 Left 2 !;op
TEXT -560 -1344 Left 2 !.option plotwinsize=0
TEXT -560 -1312 Left 2 !.option noopiter
TEXT -560 -1616 Left 2 ;Transient
TEXT -560 -1456 Left 2 !.four {freq} 10 10 v(SPK+,SPK-)
TEXT 144 -1520 Left 2 !.param prb=0
TEXT -560 -1520 Left 2 !.param timestep {1/((262144/8)*freq)}
TEXT -560 -1552 Left 2 !.param freq 20k
TEXT -560 -1488 Left 2 !.param stoptime {iterations/freq}
TEXT 144 -1584 Left 2 !;ac oct 100 10 100meg
TEXT 144 -1552 Left 2 ;.step param prb list -1 1
TEXT 144 -1616 Left 2 ;AC analysis
TEXT -560 -1424 Left 2 !.param iterations 80
TEXT -224 -1280 Left 2 !.lib usr/ONNN_BJT.lib
TEXT 152 -1280 Left 2 !.param Zimp 6
TEXT 2144 -1216 Left 2 !.param Zreal Zimp/2
TEXT 2144 -1184 Left 2 !.param Zimg (Zimp*sqrt(3))/(4*pi*freq)
TEXT 152 -1248 Left 2 !.param supplyPWR 100
TEXT 152 -1216 Left 2 !.param supplyVLT 24
TEXT -224 -1216 Left 2 !.lib usr/STM_D.lib
TEXT -224 -1312 Left 2 !.lib usr/FCS_BJT.lib
TEXT 152 -1312 Left 2 !.param voutput 25
TEXT 152 -1184 Left 2 !.param supplyK 0.06
TEXT 2832 304 Left 2 !.param rser {(supplyVLT*supplyVLT*supplyK)/(2*supplyPWR)}
TEXT -560 -1584 Left 2 !.tran 0 {stoptime} 0 {timestep}
TEXT 2832 336 Left 2 !.param phi 90
TEXT 504 -1312 Left 2 !.param con1_len 10
TEXT 2832 272 Left 2 !KCON1 LVCC LSGND LGSPK2 LPGND LPWRGND1 LPWRGND2 LVEE LDGND 0.8
TEXT 504 -1280 Left 2 !.param con2_len 10
TEXT 2144 -1248 Left 2 !KCON2 LSPKP LSPKN2 0.8
TEXT 2128 -1616 Left 2 ;Konektor zvucnika i zvucnik
TEXT 2800 -1616 Left 2 ;Konektor napajanja, star ground i napajanje
TEXT 1200 -1616 Left 2 ;Negativna povratna sprega
TEXT 152 -1344 Left 2 ;Ulazni parametri kola
TEXT 992 -1616 Center 2 ;AC sonda
TEXT -224 -1344 Left 2 !.lib usr/FCS_D.lib
TEXT 504 -1248 Left 2 !.param BIAS 0.48
TEXT -224 -1248 Left 2 !.lib usr/ONNN_D.lib
TEXT 1744 -1176 Left 2 !.param knfb 1p
TEXT 1200 -1176 Left 2 !.param vinput voutput*(nfb1/nfb2)
TEXT 504 -1216 Left 2 !.param nfb1 100
TEXT 504 -1184 Left 2 !.param nfb2 1k8
TEXT -224 -1184 Left 2 !.lib usr/TSE_BJT.lib
TEXT -544 -1192 Left 2 !.lib usr/TXN_IC.lib
RECTANGLE Normal 96 -1632 -576 -1392
RECTANGLE Normal 96 -1152 -576 -1360
RECTANGLE Normal 800 -1632 128 -1392
RECTANGLE Normal 2720 -1152 2112 -1632 2
RECTANGLE Normal 1120 -1152 864 -1632 2
RECTANGLE Normal 3168 -816 2928 -1584 2
RECTANGLE Normal 2048 -1152 1184 -1632 2
RECTANGLE Normal 800 -1152 128 -1360
RECTANGLE Normal 3872 384 2784 -1632 2

The netlist it stands for:
* nano.asc
R12 nfb N004 {nfb1}
V2 N041 0 SINE(0 {supplyVLT*sqrt(2)} 50 1m 0 {phi}) Rser={rser}
Ii xp x 0 AC {u(prb)}
Vi x AC2 0 AC {u(-prb)}
Q11 N044 pin N037 0 CA_BC560C
R33 N039 pin {nfb1}
R34 pin sgnd {nfb2}
R2 N056 N059 100
R3 N057 N059 100
R9 N028 N037 100
R10 N028 N038 100
R16 vcc+ N022 39
Q12 N029 N026 N022 0 2SA1381F
D7 out vcc+ 1N5404
D8 vcc- out 1N5404
LTRF out speaker 2µ Rser=10m Rpar=3meg Cpar=1p
R19 out speaker 2.2
R20 N005 nfb {nfb2}
V1 x AC1 0
D6 N041 N003 GBPC3502
D9 N024 N040 GBPC3502
V3 0 N040 SINE(0 {supplyVLT*sqrt(2)} 50 1m 0 {phi}) Rser={rser}
R54 out N043 10
R60 SPK+ N008 {Zreal}
L19 N008 SPK- {Zimg} Cpar=10p
V18 xp pwrgnd 0
Q17 vcc- N051 N049 0 2SA1837
Q18 vcc+ N031 N032 0 2SC4793
R27 N031 N030 22
R30 N051 N047 22
C24 N043 pwrgnd 100n Rser=700m Lser=7n Rpar=4.4meg Cpar=1p
C25 vcc- pwrgnd 100n Rser=700m Lser=7n Rpar=4.4meg Cpar=1p
C2 N004 sgnd 2200µ V=6.3 Irms=1.44 Rser=0.09 Lser=5.5n Rpar=1110k Cpar=3p mfg="Nichicon" pn="UPW0J222MPD6TD" type="Al electrolytic"
R47 vcc+ N019 100
R§PBIAS1 N034 N042 {1+(500*BIAS)}
R52 N029 N034 1k2
R53 N030 N029 11
D10 N040 N003 GBPC3502
D11 N024 N041 GBPC3502
LVCC vcc+ N002 {con1_len*20n} Rser={con1_len*.5m}
LVEE vcc- N023 {con1_len*20n} Rser={con1_len*.5m}
Q3 N047 N055 N058 0 2SC3503F
R6 N058 N059 12
V11 sinus sgnd SINE(0 {vinput} {freq})
R4 N026 N027 7k5
R1 N032 N049 47
Q1 N028 N025 N019 0 2SA1381F
Q7 N054 nfb N038 0 CA_BC560C
Q21 N030 N034 N047 0 MJE340
R17 vcc- N059 22
LGSPK2 gspk N010 {con1_len*20n} Rser={con1_len*.5m}
LPWRGND2 pwrgnd N017 {con1_len*20n} Rser={con1_len*.5m}
LPGND pgnd N013 {con1_len*20n} Rser={con1_len*.5m}
LSGND sgnd N006 {con1_len*20n} Rser={con1_len*.5m}
R18 N003 N002 25m
R26 N011 N010 25m
R28 N016 N017 25m
R29 N014 N013 25m
R32 N007 N006 50m
R38 N024 N023 25m
L4 N016 0 4n Rser=1m
L5 N014 N016 2n Rser=1m
L6 N011 N014 2n Rser=1m
L18 N007 N011 2n Rser=1m
LSPKP speaker N001 {con2_len*20n} Rser={con2_len*.5m}
LSPKN2 gspk N012 {con2_len*20n} Rser={con2_len*.5m}
R41 SPK+ N001 15m
R43 SPK- N012 15m
LDGND pwrgnd N018 {con1_len*20n} Rser={con1_len*.5m}
R31 N016 N018 25m
LPWRGND1 pwrgnd N015 {con1_len*20n} Rser={con1_len*.5m}
R25 N016 N015 25m
C10 pwrgnd N059 100n Rser=700m Lser=7n Rpar=4.4meg Cpar=1p
V7 N052 sgnd PULSE(0 {vinput/2} 1u 1n 1n {1/(freq*2)} {1/freq})
V8 impulse N052 PULSE(0 {-vinput/2} {1u+(1/(freq*2))} 1n 1n {1/(freq*2)} {1/freq})
C11 N039 sinus 220µ V=6.3 Irms=290m Rser=0.5 Lser=3n Rpar=1100k Cpar=3p mfg="Nichicon" pn="UPW0J221MED1TD" type="Al electrolytic"
C12 pwrgnd N059 470µ V=6.3 Irms=290m Rser=0.5 Lser=3n Rpar=1100k Cpar=3p
C17 pwrgnd vcc- 1000µ V=63 Irms=2.77 Rser=0.036 Lser=5n Rpar=900k Cpar=3p mfg="Nichicon" pn="UPW1J102MHD6" type="Al electrolytic"
C21 N030 N047 22µ V=100 Irms=250m Rser=0.71 Lser=2n Rpar=2meg Cpar=2p mfg="Nichicon" pn="UPW1J220MED" type="Al electrolytic"
R37 N042 N047 240
V4 preout AC1 0
V6 out AC2 0
V9 N053 sgnd SINE(0 {vinput/2} 19k)
V10 imd N053 SINE(0 {vinput/2} 20k 0 0)
L2 N005 out {20n+knfb}
R82 N027 pgnd 7k5
Q4 vcc+ N033 N035 0 MJL3281A
Q9 vcc- N050 N048 0 MJL1302A
R5 N033 N032 2
R68 N050 N049 2
C3 N046 N045 100p Rser=140m Lser=3n Rpar=7.4meg
R13 N005 N009 6k8
C9 N009 nfb 12p Rser=140m Lser=3n Rpar=7.4meg
R45 N025 pgnd 15k
Q6 N054 N054 N057 0 CA_BC550C
Q8 N044 N054 N056 0 CA_BC550C
R15 N022 N021 1k
R44 N020 N019 1k
Q2 pgnd N044 N055 0 CA_BC550C
R7 N055 N059 510
C5 N047 N046 1n Rser=140m Lser=3n Rpar=7.4meg
R8 preout N046 510
D1 N044 N047 BAV21
Q5 N025 N020 vcc+ 0 CA_BC560C
Q10 N026 N021 vcc+ 0 CA_BC560C
R11 N045 N044 10
C1 vcc+ N027 4µ7 Rser=700m Lser=7n Rpar=4.4meg Cpar=1p
R14 N035 preout 0.22
R21 preout N048 0.22
C7 N024 N040 100n Rser=700m Lser=7n Rpar=4.4meg Cpar=1p
C8 N024 N041 100n Rser=700m Lser=7n Rpar=4.4meg Cpar=1p
C13 N003 N041 100n Rser=700m Lser=7n Rpar=4.4meg Cpar=1p
C15 N003 N040 100n Rser=700m Lser=7n Rpar=4.4meg Cpar=1p
C18 0 N024 220µ V=50 Irms=1.04 Rser=0.075 Lser=0 Rpar=40k Cpar=3p mfg="Nichicon" pn="UPL1H221MPH" type="Al electrolytic"
C19 N003 0 220µ V=50 Irms=1.04 Rser=0.075 Lser=0 Rpar=40k Cpar=3p mfg="Nichicon" pn="UPL1H221MPH" type="Al electrolytic"
C22 0 N041 100n Rser=700m Lser=7n Rpar=4.4meg Cpar=1p
C23 N040 0 100n Rser=700m Lser=7n Rpar=4.4meg Cpar=1p
C26 N040 N041 10n Rser=700m Lser=7n Rpar=4.4meg Cpar=1p
C30 0 N024 10m V=50 Irms=2.5 Rser=0.08 Lser=20n Rpar=40k Cpar=3p
C6 N003 0 10m V=50 Irms=2.5 Rser=0.08 Lser=20n Rpar=40k Cpar=3p
R42 0 N024 10k
R46 N003 0 10k
C16 N024 0 100n Rser=700m Lser=7n Rpar=4.4meg Cpar=1p
C29 0 N003 100n Rser=700m Lser=7n Rpar=4.4meg Cpar=1p
C31 N024 N003 100n Rser=700m Lser=7n Rpar=4.4meg Cpar=1p
C32 vcc+ pwrgnd 1000µ V=63 Irms=2.77 Rser=0.036 Lser=5n Rpar=900k Cpar=3p mfg="Nichicon" pn="UPW1J102MHD6" type="Al electrolytic"
C33 vcc+ pwrgnd 100n Rser=700m Lser=7n Rpar=4.4meg Cpar=1p
R48 sinus sgnd 100k
R49 sgnd gspk 10
C4 sgnd pin 2n2 Rser=140m Lser=3n Rpar=7.4meg
D4 N004 sgnd 1N4148
D5 sgnd N004 1N4148
Q13 prot N036 N048 0 BC847A
R22 N036 N035 470
R23 N036 N048 100
R24 vcc+ prot 10k
.model D D
.lib standard.dio
.model NPN NPN
.model PNP PNP
.lib standard.bjt
;op
.option plotwinsize=0
.option noopiter
* Transient
.four {freq} 10 10 v(SPK+,SPK-)
.param prb=0
.param timestep {1/((262144/8)*freq)}
.param freq 20k
.param stoptime {iterations/freq}
;ac oct 100 10 100meg
* .step param prb list -1 1
* AC analysis
.param iterations 80
.lib usr/ONNN_BJT.lib
.param Zimp 6
.param Zreal Zimp/2
.param Zimg (Zimp*sqrt(3))/(4*pi*freq)
.param supplyPWR 100
.param supplyVLT 24
.lib usr/STM_D.lib
.lib usr/FCS_BJT.lib
.param voutput 25
.param supplyK 0.06
.param rser {(supplyVLT*supplyVLT*supplyK)/(2*supplyPWR)}
.tran 0 {stoptime} 0 {timestep}
.param phi 90
.param con1_len 10
KCON1 LVCC LSGND LGSPK2 LPGND LPWRGND1 LPWRGND2 LVEE LDGND 0.8
.param con2_len 10
KCON2 LSPKP LSPKN2 0.8
* Konektor zvucnika i zvucnik
* Konektor napajanja, star ground i napajanje
* Negativna povratna sprega
* Ulazni parametri kola
* AC sonda
.lib usr/FCS_D.lib
.param BIAS 0.48
.lib usr/ONNN_D.lib
.param knfb 1p
.param vinput voutput*(nfb1/nfb2)
.param nfb1 100
.param nfb2 1k8
.lib usr/TSE_BJT.lib
.lib usr/TXN_IC.lib
.backanno
.end